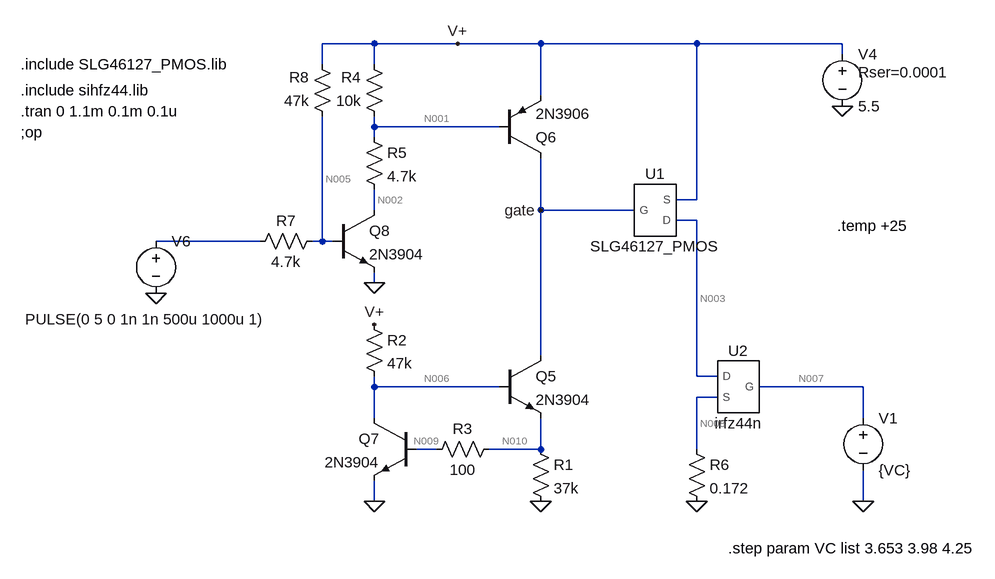
[diagram p0: schematic PFETchar_model.asc]
PFETchar_model.asc, the LTspice schematic file:
Version 4
SHEET 1 2920 2028
WIRE -160 -400 -240 -400
WIRE -32 -400 -160 -400
WIRE 96 -400 -32 -400
WIRE 336 -400 96 -400
WIRE 560 -400 336 -400
WIRE 560 -384 560 -400
WIRE -240 -368 -240 -400
WIRE -160 -368 -160 -400
WIRE 96 -320 96 -400
WIRE -160 -272 -160 -288
WIRE 32 -272 -160 -272
WIRE -160 -256 -160 -272
WIRE 336 -160 336 -400
WIRE 336 -160 304 -160
WIRE -160 -144 -160 -176
WIRE 96 -144 96 -224
WIRE 240 -144 96 -144
WIRE 336 -128 304 -128
WIRE -336 -96 -496 -96
WIRE -240 -96 -240 -288
WIRE -240 -96 -256 -96
WIRE -224 -96 -240 -96
WIRE -160 -32 -160 -48
WIRE 96 80 96 -144
WIRE 336 112 336 -128
WIRE 368 112 336 112
WIRE -160 128 -160 112
WIRE 32 128 -160 128
WIRE 592 128 432 128
WIRE 368 144 336 144
WIRE -160 176 -160 128
WIRE 592 176 592 128
WIRE -64 224 -96 224
WIRE 96 224 96 176
WIRE 96 224 16 224
WIRE 336 224 336 144
WIRE -160 304 -160 272
WIRE 592 304 592 256
FLAG 96 304 0
FLAG 560 -304 0
FLAG -496 -16 0
FLAG 96 -144 gate
FLAG -160 304 0
FLAG -160 32 V+
FLAG -32 -400 V+
FLAG -160 -32 0
FLAG 336 304 0
FLAG 592 304 0
SYMBOL res 80 208 R0
SYMATTR InstName R1
SYMATTR Value 37k
SYMBOL res 32 208 R90
WINDOW 0 0 56 VBottom 2
WINDOW 3 32 56 VTop 2
SYMATTR InstName R3
SYMATTR Value 100
SYMBOL voltage 560 -400 R0
WINDOW 123 0 0 Left 2
WINDOW 39 24 44 Left 2
SYMATTR SpiceLine Rser=0.0001
SYMATTR InstName V4
SYMATTR Value 5.5
SYMBOL voltage -496 -112 R0
WINDOW 3 -201 136 Left 2
WINDOW 123 0 0 Left 2
WINDOW 39 0 0 Left 2
SYMATTR Value PULSE(0 5 0 1n 1n 500u 1000u 1)
SYMATTR InstName V6
SYMBOL npn 32 80 R0
SYMATTR InstName Q5
SYMATTR Value 2N3904
SYMBOL pnp 32 -224 M180
SYMATTR InstName Q6
SYMATTR Value 2N3906
SYMBOL res -240 -112 R90
WINDOW 0 0 56 VBottom 2
WINDOW 3 32 56 VTop 2
SYMATTR InstName R7
SYMATTR Value 4.7k
SYMBOL npn -96 176 M0
SYMATTR InstName Q7
SYMATTR Value 2N3904
SYMBOL res -176 16 R0
SYMATTR InstName R2
SYMATTR Value 47k
SYMBOL res -144 -272 R180
WINDOW 0 36 76 Left 2
WINDOW 3 36 40 Left 2
SYMATTR InstName R4
SYMATTR Value 10k
SYMBOL npn -224 -144 R0
SYMATTR InstName Q8
SYMATTR Value 2N3904
SYMBOL res -176 -272 R0
SYMATTR InstName R5
SYMATTR Value 4.7k
SYMBOL res -224 -272 R180
WINDOW 0 36 76 Left 2
WINDOW 3 36 40 Left 2
SYMATTR InstName R8
SYMATTR Value 47k
SYMBOL SLG46127_PMOS 272 -144 R0
SYMATTR InstName U1
SYMBOL res 320 208 R0
SYMATTR InstName R6
SYMATTR Value 0.172
SYMBOL voltage 592 160 R0
WINDOW 123 0 0 Left 2
WINDOW 39 24 124 Left 2
SYMATTR InstName V1
SYMATTR Value {VC}
SYMBOL irfz44n 400 128 M0
SYMATTR InstName U2
TEXT -704 -264 Left 2 !;op
TEXT -704 -296 Left 2 !.tran 0 1.1m 0.1m 0.1u
TEXT -704 -328 Left 2 !.include sihfz44.lib
TEXT 552 -120 Left 2 !.temp +25
TEXT 384 376 Left 2 !.step param VC list 3.653 3.98 4.25
TEXT -704 -368 Left 2 !.include SLG46127_PMOS.lib

The netlist it stands for:
* PFETchar_model.asc
R1 N010 0 37k
R3 N010 N009 100
V4 V+ 0 5.5 Rser=0.0001
V6 N004 0 PULSE(0 5 0 1n 1n 500u 1000u 1)
Q5 gate N006 N010 0 2N3904
Q6 gate N001 V+ 0 2N3906
R7 N005 N004 4.7k
Q7 N006 N009 0 0 2N3904
R2 V+ N006 47k
R4 N001 V+ 10k
Q8 N002 N005 0 0 2N3904
R5 N001 N002 4.7k
R8 N005 V+ 47k
XU1 N003 gate V+ SLG46127_PMOS  ; pins D G S
R6 N008 0 0.172
V1 N007 0 {VC}
XU2 N003 N007 N008 irfz44n  ; pins D G S
.model NPN NPN
.model PNP PNP
.lib standard.bjt
;op
.tran 0 1.1m 0.1m 0.1u
.include sihfz44.lib
.temp +25
.step param VC list 3.653 3.98 4.25
.include SLG46127_PMOS.lib
.lib SLG46127_PMOS.lib
.lib sihfz44.lib
.backanno
.end

* Results of the author's LTspice run, read from the files saved beside the schematic
* Operating Point (first step), zero values left out:
*   vc = 3.653 
*   V(n010) = 592.2 mV
*   V(n009) = 592.2 mV
*   V(v+) = 5.5 V
*   V(gate) = 598 mV
*   V(n006) = 1.186 V
*   V(n001) = 5.478 V
*   V(n005) = 500 mV
*   V(n002) = 5.468 V
*   V(n003) = 5.497 V
*   V(n008) = 17.03 mV
*   V(n007) = 3.653 V
*   Ic(Q6) = -4.899 pA
*   Ib(Q6) = 4.86 pA
*   Ic(Q8) = 2.18 µA
*   Ib(Q8) = 6.989 nA
*   Ie(Q8) = -2.187 µA
*   Ic(Q7) = 75.53 µA
*   Ib(Q7) = 252.8 nA
*   Ie(Q7) = -75.78 µA
*   Ic(Q5) = 4.899 pA
*   Ib(Q5) = 16.26 µA
*   Ie(Q5) = -16.26 µA
*   I(R6) = 99 mA
*   I(R8) = -106.4 µA
*   I(R5) = 2.18 µA
*   I(R4) = -2.18 µA
*   I(R2) = 91.79 µA
*   I(R7) = 106.4 µA
*   I(R3) = 252.8 nA
*   I(R1) = 16.01 µA
*   I(V1) = 1.844 pA
*   I(V6) = 106.4 µA
*   I(V4) = -99.2 mA
*   Ix(u1:1) = -99 mA
*   Ix(u1:3) = 99 mA
*   Ix(u2:1) = 99 mA
*   Ix(u2:2) = -1.844 pA
*   Ix(u2:3) = -99 mA
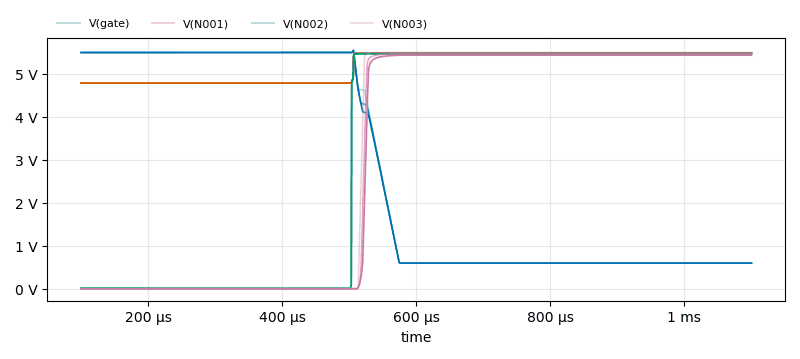
[diagram p1: Transient Analysis of PFETchar_model.asc, plotted from the saved traces]
* Transient Analysis, 5 runs:
*   V(gate) [run 1]: min 598 mV, max 5.544 V, average 2.762 V, rms 3.642 V, last 598 mV
*   V(gate) [run 2]: 5.494 V at time=100 µs, 5.494 V at time=100 µs, min 5.494 V, max 5.494 V
*   V(gate) [run 3]: min 598 mV, max 5.544 V, average 2.757 V, rms 3.637 V, last 598 mV
*   V(gate) [run 4]: 5.494 V at time=100 µs, 5.494 V at time=100 µs, min 5.494 V, max 5.494 V
*   V(gate) [run 5]: min 598 mV, max 5.544 V, average 2.754 V, rms 3.634 V, last 598 mV
*   V(N001) [run 1]: min 4.783 V, max 5.478 V, average 5.196 V, rms 5.207 V, last 5.478 V
*   V(N001) [run 2]: 4.783 V at time=100 µs, 4.783 V at time=100 µs, min 4.783 V, max 4.783 V
*   V(N001) [run 3]: min 4.783 V, max 5.478 V, average 5.196 V, rms 5.207 V, last 5.478 V
*   V(N001) [run 4]: 4.783 V at time=100 µs, 4.783 V at time=100 µs, min 4.783 V, max 4.783 V
*   V(N001) [run 5]: min 4.783 V, max 5.478 V, average 5.196 V, rms 5.207 V, last 5.478 V
*   V(N002) [run 1]: min 5.912 mV, max 5.468 V, average 3.265 V, rms 4.221 V, last 5.468 V
*   V(N002) [run 2]: 11.1 mV at time=100 µs, 11.1 mV at time=100 µs, min 11.1 mV, max 11.1 mV
*   V(N002) [run 3]: min 5.912 mV, max 5.468 V, average 3.265 V, rms 4.221 V, last 5.468 V
*   V(N002) [run 4]: 11.1 mV at time=100 µs, 11.1 mV at time=100 µs, min 11.1 mV, max 11.1 mV
*   V(N002) [run 5]: min 5.912 mV, max 5.468 V, average 3.265 V, rms 4.221 V, last 5.468 V
*   V(N003) [run 1]: min -1.709 µV, max 5.497 V, average 3.198 V, rms 4.187 V, last 5.497 V
*   V(N003) [run 2]: -3.495 µV at time=100 µs, -3.495 µV at time=100 µs, min -3.495 µV, max -3.495 µV
*   V(N003) [run 3]: min -3.495 µV, max 5.465 V, average 3.159 V, rms 4.148 V, last 5.465 V
*   V(N003) [run 4]: -773.2 nV at time=100 µs, -773.2 nV at time=100 µs, min -773.2 nV, max -773.2 nV
*   V(N003) [run 5]: min -811 nV, max 5.432 V, average 3.127 V, rms 4.113 V, last 5.432 V